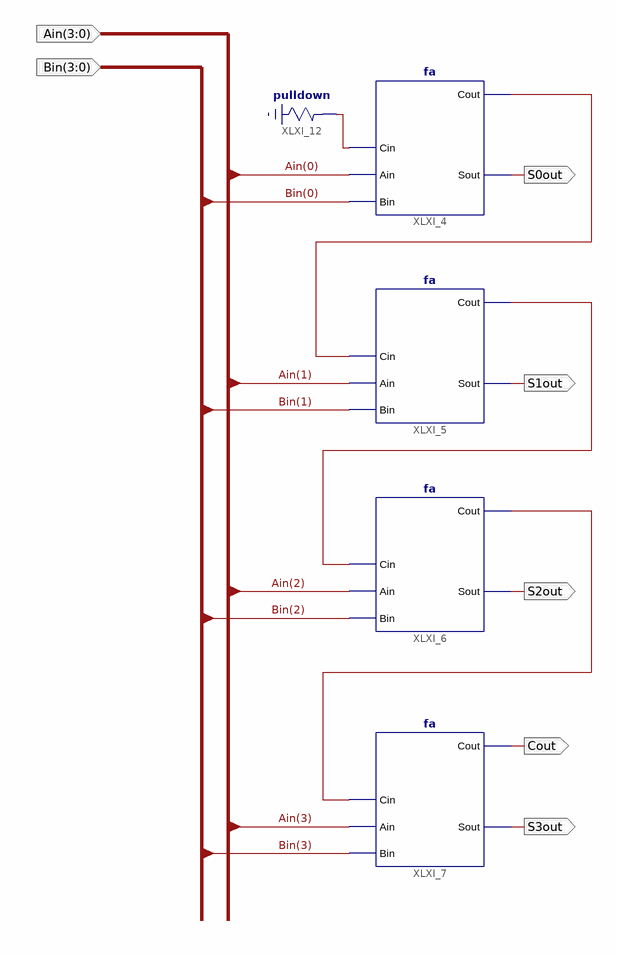
[diagram p0: schematic sheet 1]
// Xilinx ISE schematic FA4b.sch (spartan3e) as structural Verilog: 5 symbols, 7 ports
module FA4b (
  input  [3:0] Ain,
  input  [3:0] Bin,
  output S0out,
  output S1out,
  output S2out,
  output S3out,
  output Cout
);

  wire XLXN_17, XLXN_22, XLXN_23, XLXN_24;

  fa XLXI_4 (.Cin(XLXN_17), .Cout(XLXN_22), .Ain(Ain[0]), .Bin(Bin[0]), .Sout(S0out));
  fa XLXI_5 (.Cin(XLXN_22), .Cout(XLXN_23), .Ain(Ain[1]), .Bin(Bin[1]), .Sout(S1out));
  fa XLXI_6 (.Cin(XLXN_23), .Cout(XLXN_24), .Ain(Ain[2]), .Bin(Bin[2]), .Sout(S2out));
  fa XLXI_7 (.Cin(XLXN_24), .Cout(Cout), .Ain(Ain[3]), .Bin(Bin[3]), .Sout(S3out));
  \pulldown  XLXI_12 (.O(XLXN_17));
endmodule
